# Altium schematic sheet WMR_V3_Sheet.SchDoc
size A3; SheetNumber: 2; SheetTotal: 2
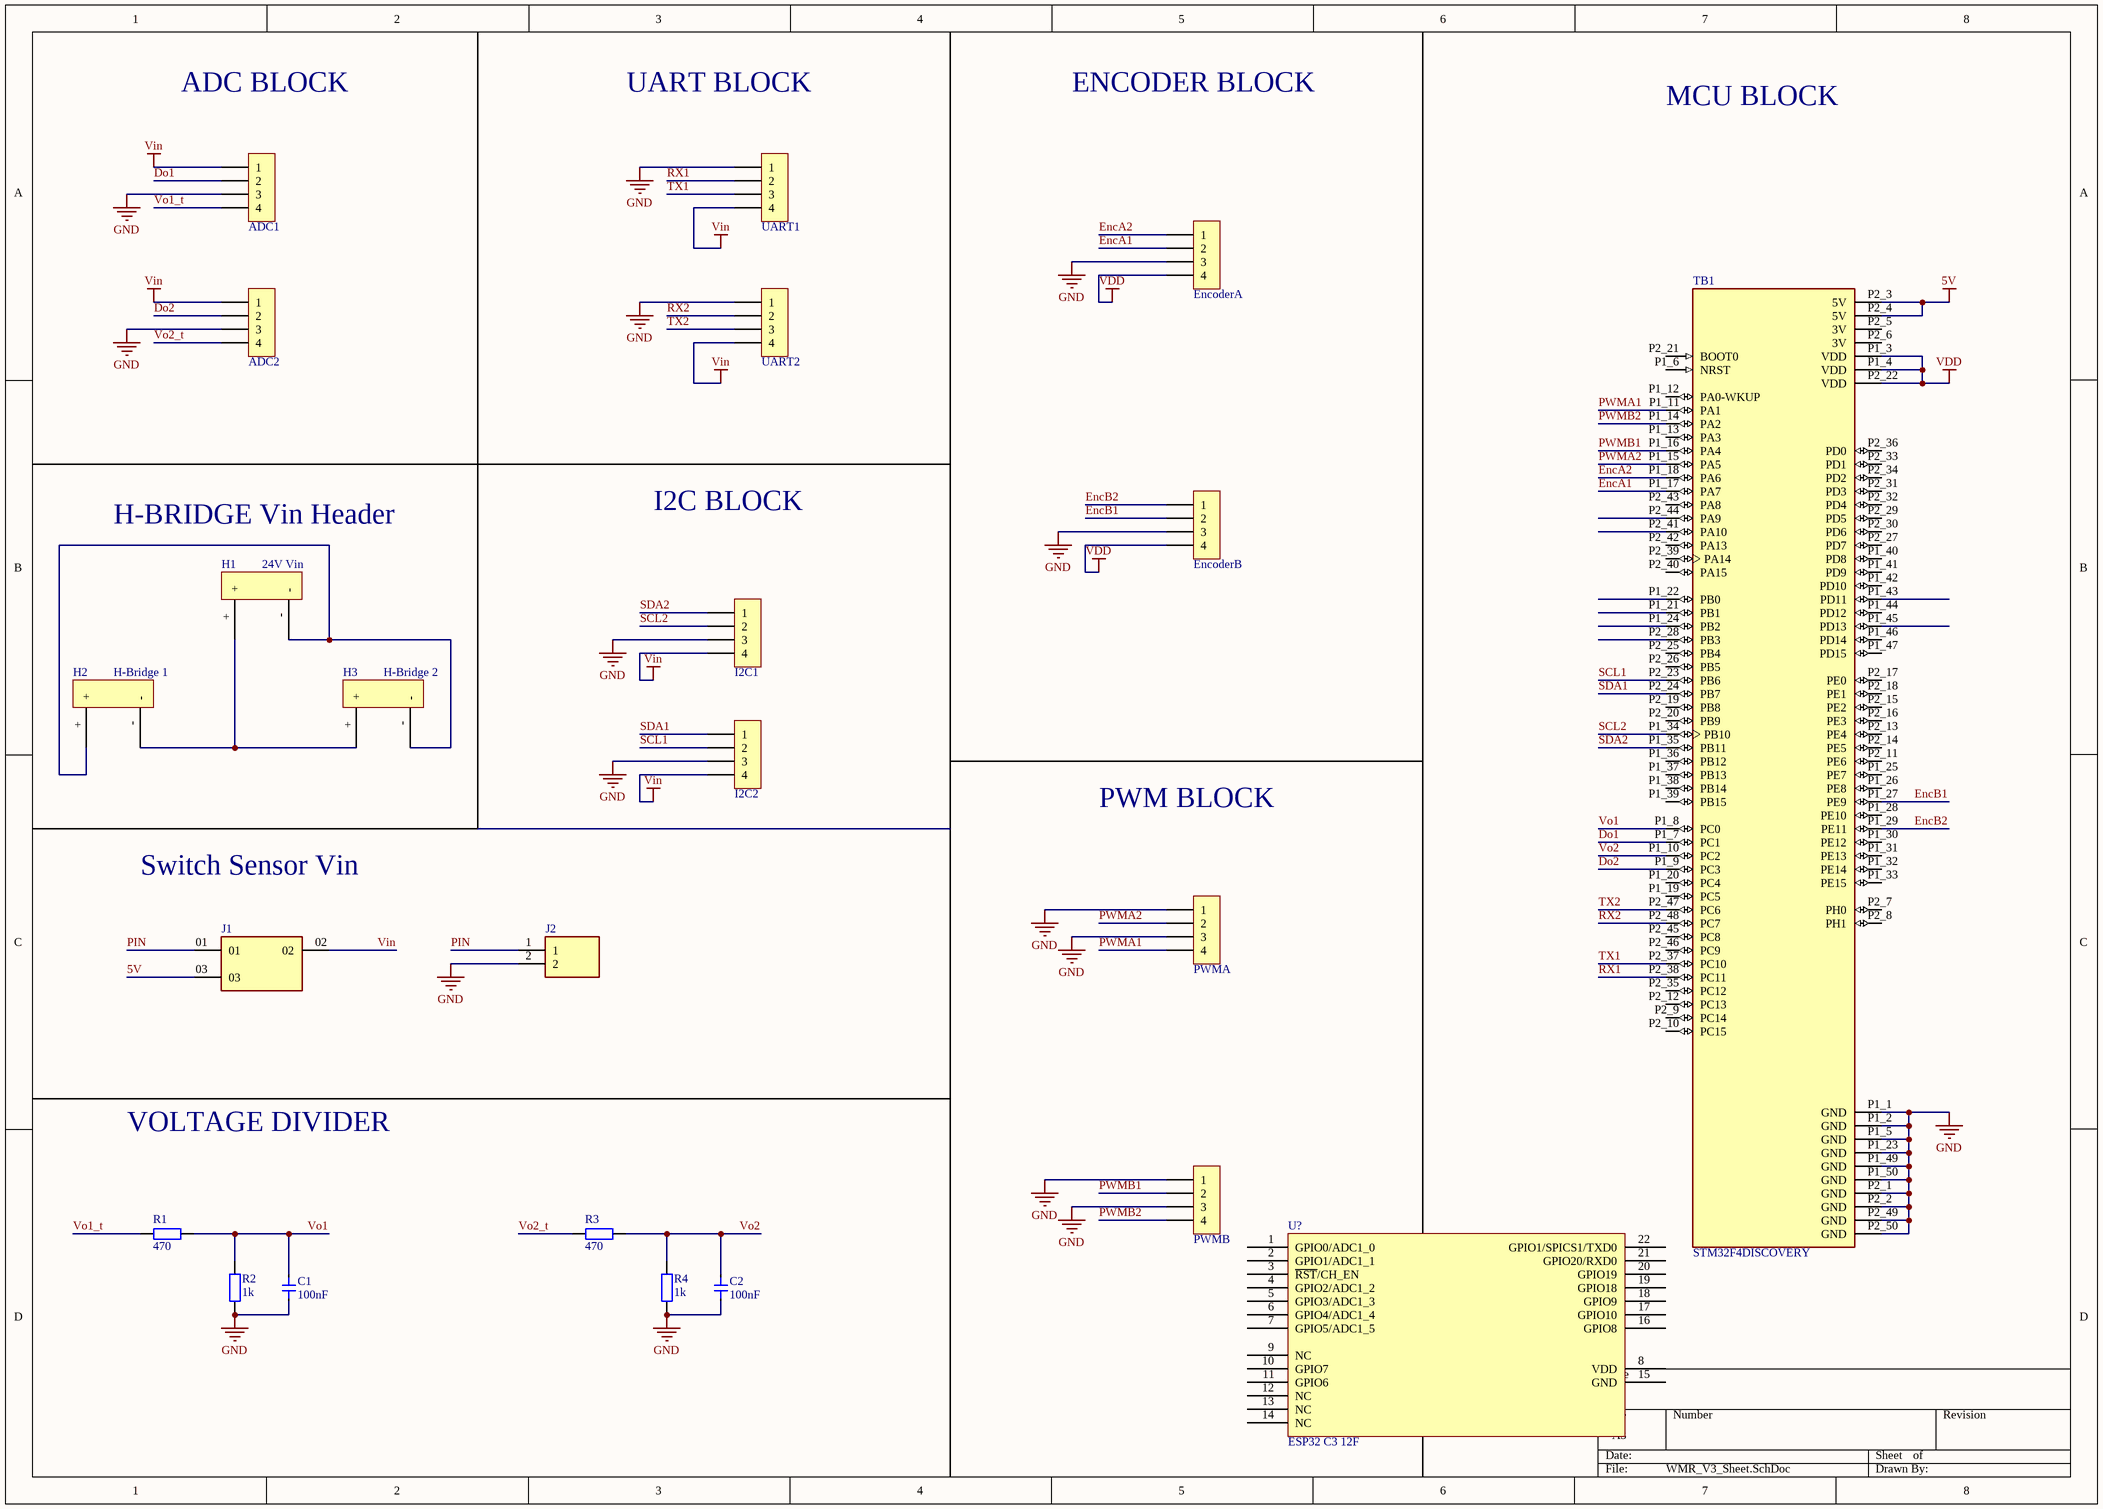
[diagram p0: WMR_V3_Sheet.SchDoc]

## Parts
C1  100nF  [Cap 1206]
C2  100nF  [Cap 1206]
H1  24V Vin  [barrier_terminal]
H2  H-Bridge 1  [barrier_terminal]
H3  H-Bridge 2  [barrier_terminal]
J1  (no value)  [SAMTEC_TSW-101-07-G-T-LL]
J2  (no value)  [MULTICOMP_MC000048]
R1  470  [tro smd 1206]
R2  1k  [tro smd 1206]
R3  470  [tro smd 1206]
R4  1k  [tro smd 1206]
TB1  STM32F4DISCOVERY  [MODULE_STM32F4DISCOVERY]
U?  ESP32 C3 12F  [ESP32 C3 12F]
XH1  EncoderA  [XH2.54M-4]
XH2  EncoderB  [XH2.54M-4]
XH3  PWMA  [XH2.54M-4]
XH4  PWMB  [XH2.54M-4]
XH5  UART1  [XH2.54M-4]
XH6  UART2  [XH2.54M-4]
XH7  I2C1  [XH2.54M-4]
XH8  I2C2  [XH2.54M-4]
XH9  ADC1  [XH2.54M-4]
XH10  ADC2  [XH2.54M-4]

## Nets
5V: J1.03 TB1.P2_3(5V) TB1.P2_4(5V)
GND: C1.2 C2.2 J2.2 R2.1 R4.1 TB1.P1_1(GND) TB1.P1_2(GND) TB1.P1_5(GND) TB1.P1_23(GND) TB1.P1_49(GND) TB1.P1_50(GND) TB1.P2_1(GND) TB1.P2_2(GND) TB1.P2_49(GND) TB1.P2_50(GND) XH1.3 XH2.3 XH3.1 XH3.3 XH4.1 XH4.3 XH5.1 XH6.1 XH7.3 XH8.3 XH9.3 XH10.3
VDD: TB1.P1_3(VDD) TB1.P1_4(VDD) TB1.P2_22(VDD) XH1.4 XH2.4
Vin: J1.02 XH5.4 XH6.4 XH7.4 XH8.4 XH9.1 XH10.1
Do1: TB1.P1_7(PC1) XH9.2
Do2: TB1.P1_9(PC3) XH10.2
EncA1: TB1.P1_17(PA7) XH1.2
EncA2: TB1.P1_18(PA6) XH1.1
EncB1: TB1.P1_27(PE9) XH2.2
EncB2: TB1.P1_29(PE11) XH2.1
PIN: J1.01 J2.1
PWMA1: TB1.P1_11(PA1) XH3.4
PWMA2: TB1.P1_15(PA5) XH3.2
PWMB1: TB1.P1_16(PA4) XH4.2
PWMB2: TB1.P1_14(PA2) XH4.4
RX1: TB1.P2_38(PC11) XH5.2
RX2: TB1.P2_48(PC7) XH6.2
SCL1: TB1.P2_23(PB6) XH8.2
SCL2: TB1.P1_34(PB10) XH7.2
SDA1: TB1.P2_24(PB7) XH8.1
SDA2: TB1.P1_35(PB11) XH7.1
TX1: TB1.P2_37(PC10) XH5.3
TX2: TB1.P2_47(PC6) XH6.3
Vo1: C1.1 R1.2 R2.2 TB1.P1_8(PC0)
Vo1_t: R1.1 XH9.4
Vo2: C2.1 R3.2 R4.2 TB1.P1_10(PC2)
Vo2_t: R3.1 XH10.4
NetH1_+: H1.+ H2.- H3.+
NetH1_-: H1.- H2.+ H3.-

Not connected (* = marked no-connect by the designer): TB1 P1_6(NRST) P1_12(PA0-WKUP) P1_13(PA3) P1_19(PC5) P1_20(PC4) P1_21(PB1) P1_22(PB0) P1_24(PB2) P1_25(PE7) P1_26(PE8) P1_28(PE10) P1_30(PE12) P1_31(PE13) P1_32(PE14) P1_33(PE15) P1_36(PB12) P1_37(PB13) P1_38(PB14) P1_39(PB15) P1_40(PD8) P1_41(PD9) P1_42(PD10) P1_43(PD11) P1_44(PD12) P1_45(PD13) P1_46(PD14) P1_47(PD15) P2_5(3V) P2_6(3V) P2_7(PH0) P2_8(PH1) P2_9(PC14) P2_10(PC15) P2_11(PE6) P2_12(PC13) P2_13(PE4) P2_14(PE5) P2_15(PE2) P2_16(PE3) P2_17(PE0) P2_18(PE1) P2_19(PB8) P2_20(PB9) P2_21(BOOT0) P2_25(PB4) P2_26(PB5) P2_27(PD7) P2_28(PB3) P2_29(PD5) P2_30(PD6) P2_31(PD3) P2_32(PD4) P2_33(PD1) P2_34(PD2) P2_35(PC12) P2_36(PD0) P2_39(PA14) P2_40(PA15) P2_41(PA10) P2_42(PA13) P2_43(PA8) P2_44(PA9) P2_45(PC8) P2_46(PC9); U? 1(GPIO0/ADC1_0) 2(GPIO1/ADC1_1) 3(~{RST}/CH_EN) 4(GPIO2/ADC1_2) 5(GPIO3/ADC1_3) 6(GPIO4/ADC1_4) 7(GPIO5/ADC1_5) 8(VDD) 9(NC) 10(GPIO7) 11(GPIO6) 12(NC) 13(NC) 14(NC) 15(GND) 16(GPIO8) 17(GPIO10) 18(GPIO9) 19(GPIO18) 20(GPIO19) 21(GPIO20/RXD0) 22(GPIO1/SPICS1/TXD0)

## Notes on the sheet
- ADC BLOCK
- UART BLOCK
- ENCODER BLOCK
- MCU BLOCK
- I2C BLOCK
- H-BRIDGE Vin Header
- PWM BLOCK
- Switch Sensor Vin
- VOLTAGE DIVIDER

## Library data of the parts
C1 C2 = Cap 1206: Capacitor SMD 1206
H1-H3 = Barrier Terminal
J1 = TSW-101-07-G-T-LL: Package: None; Price: None; Value: *; MP: TSW-101-07-G-T-LL; Availability: Unavailable
J2 = MC000048: TERMINAL BLOCK, PCB, 2WAY, 26-12AWG; Connector Type: PCB Terminal Block; Connector Mounting: PCB; Pitch Spacing: 5.08...; MF: Multicomp; SnapEDA_Link: https://www.snapeda.com/parts/MC000048/Multicomp/view-part/?ref=snap; Package: None; Value: *; MP: MC000048; Check_prices: https://www.snapeda.com/parts/MC000048/Multicomp/view-part/?ref=eda
R1-R4 = Tro 1206 1% 470k: Dán; Don_Vi: Con; Ten_Linh_Kien: Trở 1206 5% 470k; So_Chan: 2; Ma_Hang: MH005899; Chung_Loai: Dán; Kieu_Chan: *
TB1 = STM32F4DISCOVERY: Development kit: ARM ST; pin strips, pin header; No.of; Availability: Unavailable; MP: STM32F4DISCOVERY; Value: *; Price: None; Package: None
U? = ESP32 C3 12F: IC: ESP8266-EX; Vendor: Ai-thinker
XH1-XH10 = Header 4P 2.54 Duc Thang: Cắm; Ten_Linh_Kien: Header 4P XH2.54-4P Đực Thẳng; Don_Vi: Con; Ma_Hang: MH001285; Chung_Loai: Cắm